# EasyEDA schematic 1-Schematic_Proyecto final.json
TITLE: Sheet_1; REV: 1.0; Date: 2021-05-19; Sheet: 1/1; Drawn By: Abigail Guadalupe Velázquez Sánchez; Company: Your Company
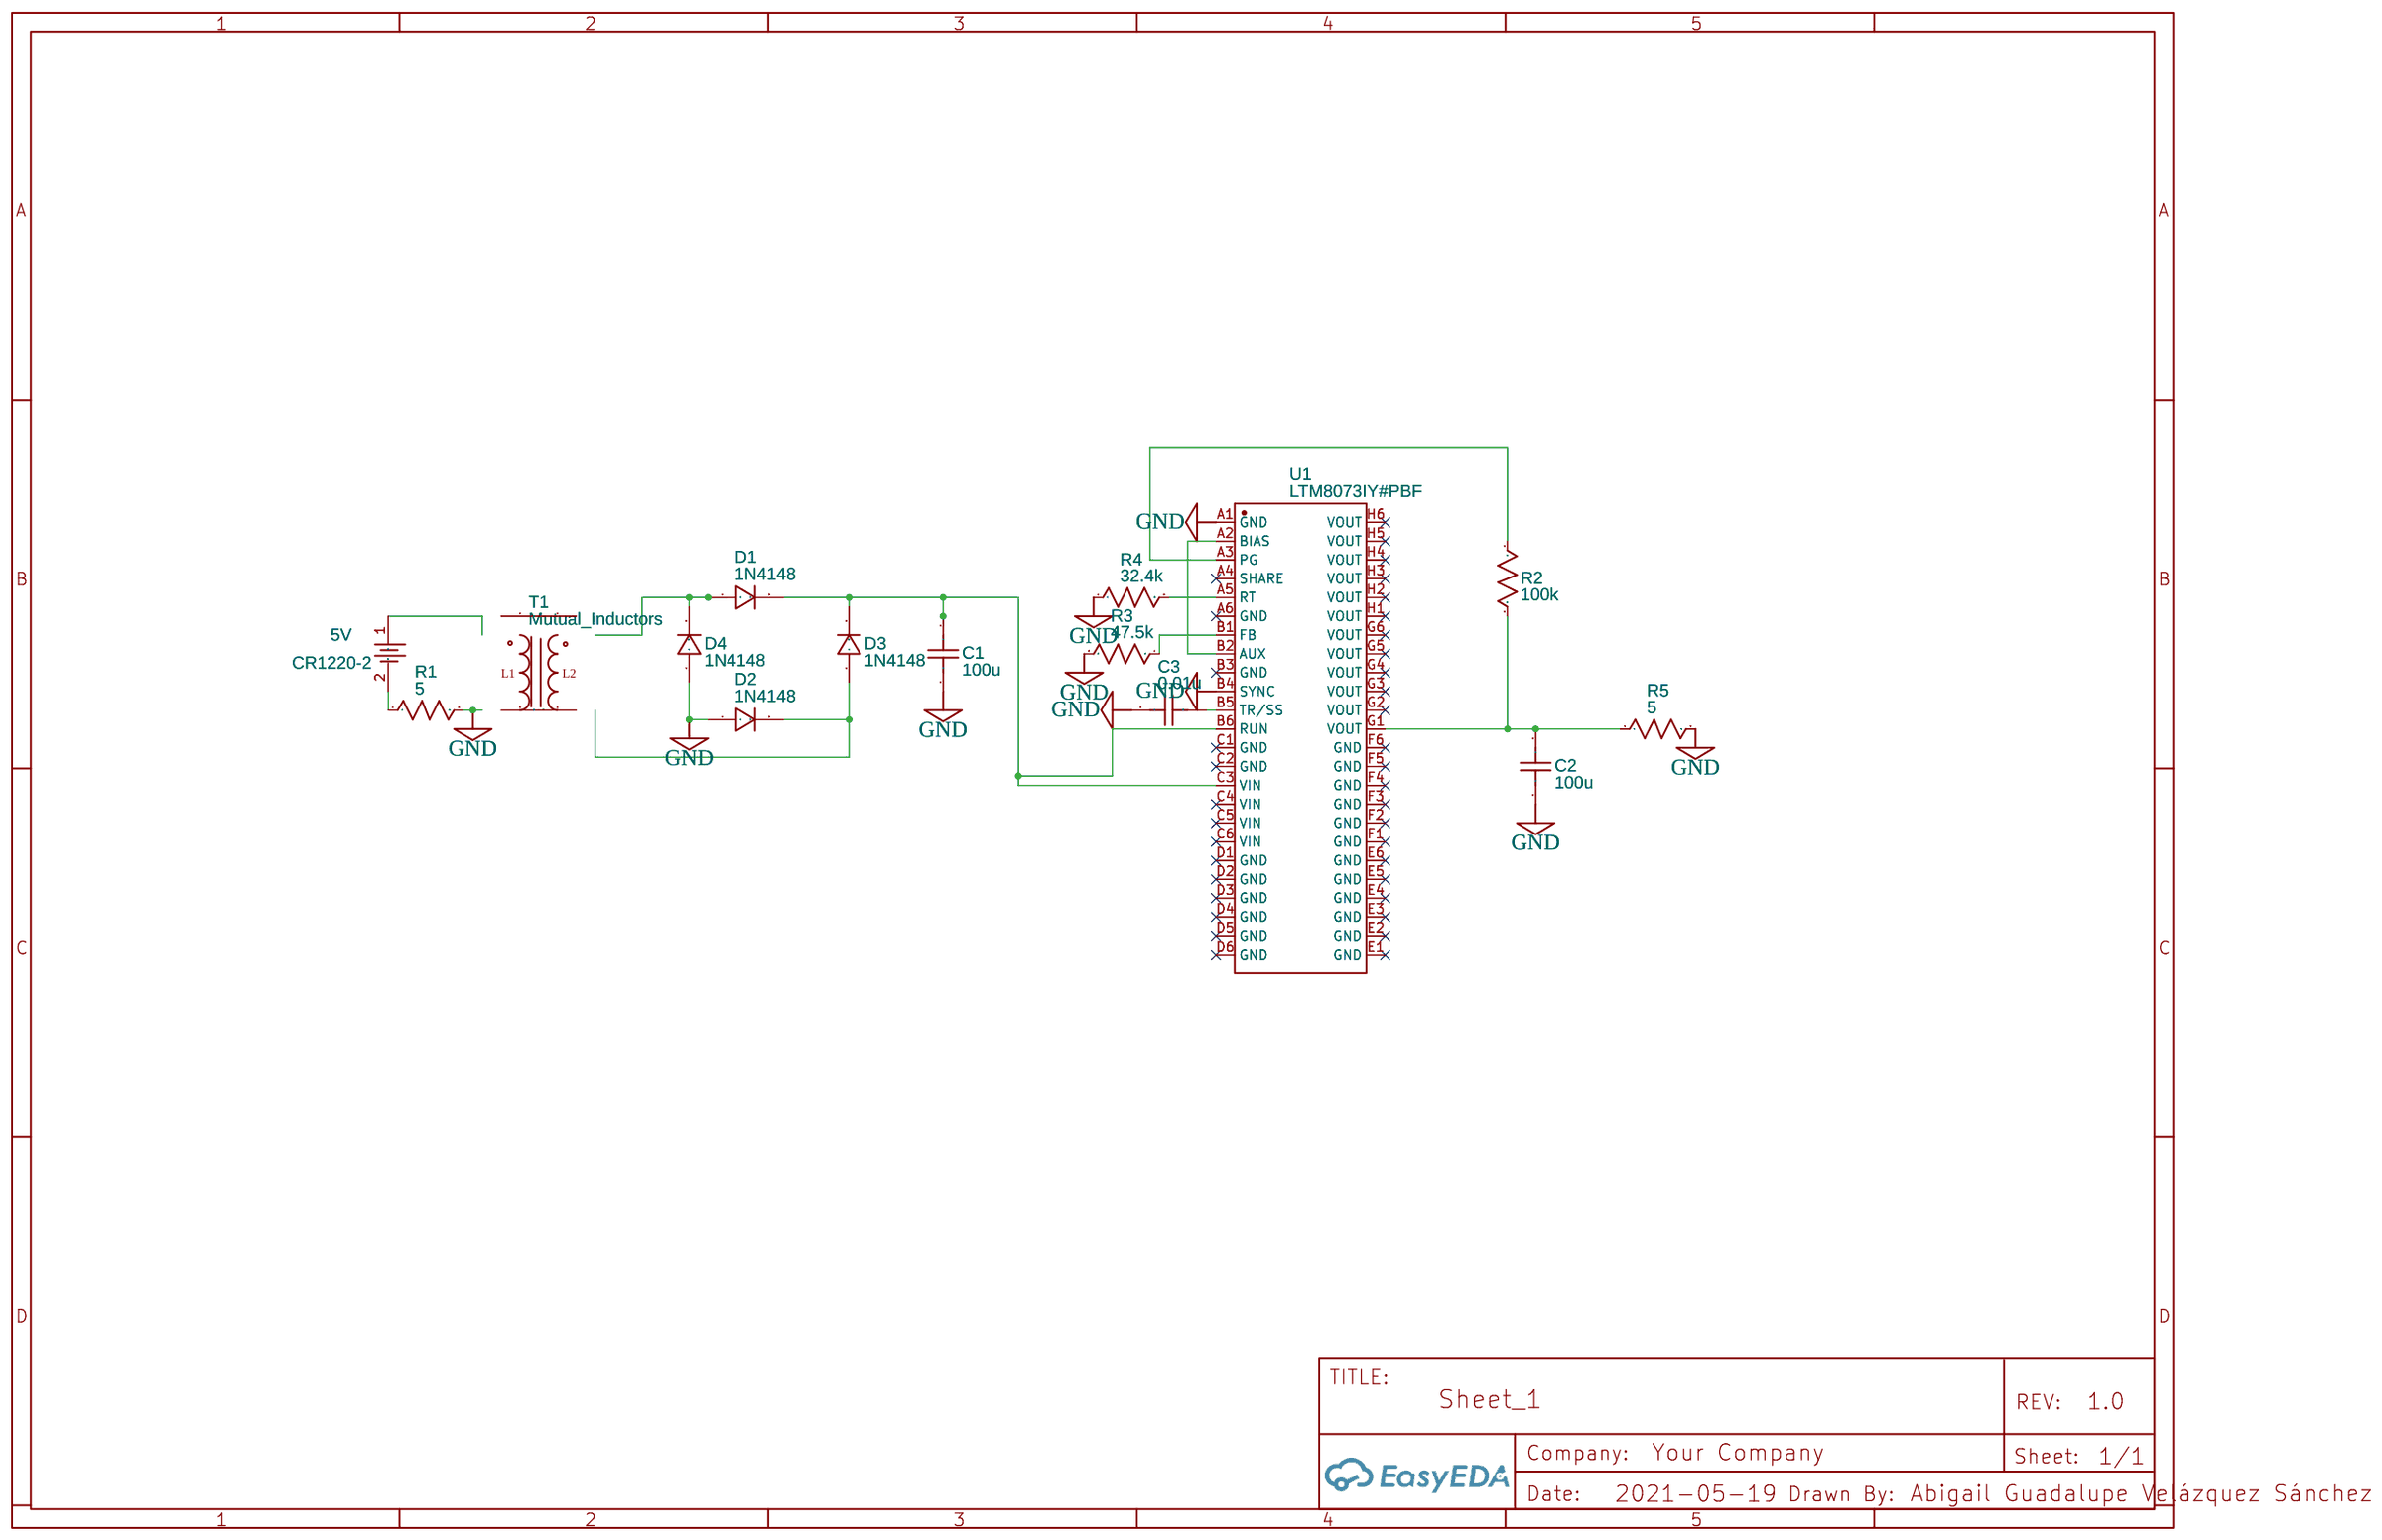
[diagram p0: schematic sheet]

## Parts
5V  CR1220-2  [BAT-SMD_CR1220-2]
C1  100u  [C0603]
C2  100u  [C0603]
C3  0.01u  [C0603]
D1  1N4148  [DO-35_BD2.0-L4.0-P8.00-D0.5-FD]
D2  1N4148  [DO-35_BD2.0-L4.0-P8.00-D0.5-FD]
D3  1N4148  [DO-35_BD2.0-L4.0-P8.00-D0.5-FD]
D4  1N4148  [DO-35_BD2.0-L4.0-P8.00-D0.5-FD]
R1  5  [R0603]
R2  100k  [R0603]
R3  47.5k  [R0603]
R4  32.4k  [R0603]
R5  5  [R0603]
T1  Mutual_Inductors  [TRANSFORMER]
U1  LTM8073IY#PBF  [BGA-48_L9.0-W6.3-R6-C8-P1.00-BL]

## Library data of the parts
5V = CR1220-2: Supplier: LCSC; Manufacturer: Q&J; image: //image.lceda.cn/szlcsc/C70381.jpg; Supplier Part: C70381
C1-C3 = C_0603_US: Contributor: LCEDA_Lib
D1-D4 = 1N4148: Supplier: LCSC; Manufacturer: SEMTECH; Supplier Part: C14516; Contributor: LCEDA_Lib
R1-R5 = R_0603_US: Contributor: LCEDA_Lib
T1 = Mutual_Inductors: Rs1: 1u; Rs2: 1u; L1: 1; L2: 2; K: 1
U1 = LTM8073IY#PBF COPY: Supplier: LCSC; Supplier Part: C690769; Manufacturer: ADI(亚德诺)/LINEAR; Contributor: LCSC

## Nets
GND: C1.1 C2.1 C3.1 D2.1 D4.1 R1.2 R3.2 R4.1 R5.2 T1.2(2 ) U1.A1(GND) U1.B4(SYNC)
Net-(5V-1): 5V.1 T1.1(1 )
Net-(5V-2): 5V.2 R1.1
Net-(C1-2): C1.2 D1.2 D3.2 U1.B6(RUN) U1.C3(VIN)
Net-(C2-2): C2.2 R2.2 R5.1 U1.G1(VOUT)
Net-(C3-2): C3.2 U1.B5(TR/SS)
Net-(D1-1): D1.1 D4.2 T1.4(4 )
Net-(D2-2): D2.2 D3.1 T1.3(3 )
Net-(R2-1): R2.1 U1.A3(PG)
Net-(R3-1): R3.1 U1.B1(FB)
Net-(R4-2): R4.2 U1.A5(RT)
Net-(U1-A2): U1.A2(BIAS) U1.B2(AUX)

Not connected (* = marked no-connect by the designer): U1 A4(SHARE)* A6(GND)* B3(GND)* C1(GND)* C2(GND)* C4(VIN)* C5(VIN)* C6(VIN)* D1(GND)* D2(GND)* D3(GND)* D4(GND)* D5(GND)* D6(GND)* E1(GND)* E2(GND)* E3(GND)* E4(GND)* E5(GND)* E6(GND)* F1(GND)* F2(GND)* F3(GND)* F4(GND)* F5(GND)* F6(GND)* G2(VOUT)* G3(VOUT)* G4(VOUT)* G5(VOUT)* G6(VOUT)* H1(VOUT)* H2(VOUT)* H3(VOUT)* H4(VOUT)* H5(VOUT)* H6(VOUT)*
